# EAGLE design mintyboostv3 (EAGLE 5.01)
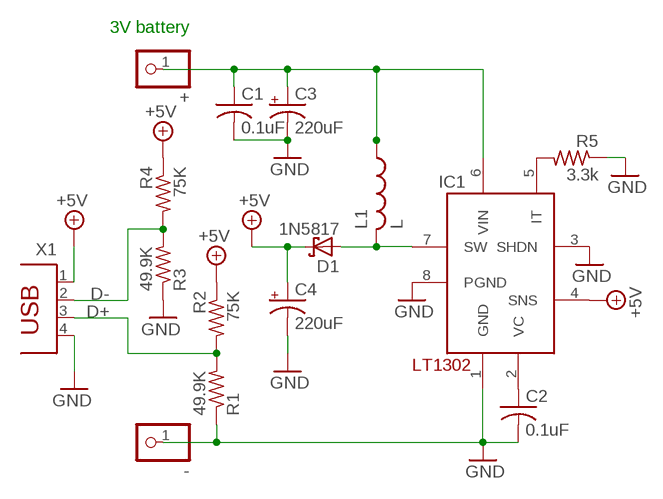
[diagram p0: schematic, sheet 1]

## Parts
+  PINHD-1X1  [1X01]
-  PINHD-1X1  [1X01]
C1  0.1uF  C-US025-025X050  [C025-025X050]
C2  0.1uF  C-US025-025X050  [C025-025X050]
C3  220uF  CPOL-USE2.5-5  [E2,5-5]
C4  220uF  CPOL-USE2.5-5  [E2,5-5]
D1  1N5817  SCHOTTKY-DIODEDO41-7  [DO41-7]
IC1  LT1302  [DIL08]
L1  L  [6000]
R1  49.9K  R-US_0204/5  [0204/5]
R2  75K  R-US_0204/5  [0204/5]
R3  49.9K  R-US_0204/5  [0204/5]
R4  75K  R-US_0204/5  [0204/5]
R5  3.3k  R-US_0204/5  [0204/5]
X1  PN87520  [PN87520]

## Nets
+5V: C4.+ D1.C IC1.4(SNS) R2.1 R4.1 X1.1
BATT+: +.1 C1.1 C3.+ IC1.6(VIN) L1.1
D+: R1.2 R2.2 X1.3
D-: R3.2 R4.2 X1.2
GND: -.1 C1.2 C2.2 C3.- C4.- IC1.1(GND) IC1.3(SHDN) IC1.8(PGND) R1.1 R3.1 R5.1 X1.4
N$1: C2.1 IC1.2(VC)
N$2: IC1.5(IT) R5.2
N$5: D1.A IC1.7(SW) L1.2

## Notes on the sheet
- 3V battery

## Library data of the parts
+ - = pinhead-ez:PINHD-1X1: PIN HEADER
C1 C2 = adafruit:C-US: CAPACITOR, American symbol
C3 C4 = adafruit:CPOL-US: POLARIZED CAPACITOR, American symbol
D1 = adafruit:SCHOTTKY-DIODE: Schottky Diode
IC1 = adafruit:LT1302
L1 = adafruit:L
R1-R5 = adafruit:R-US_: RESISTOR, American symbol
X1 = con-berg:PN87520: BERG USB connector

## Board
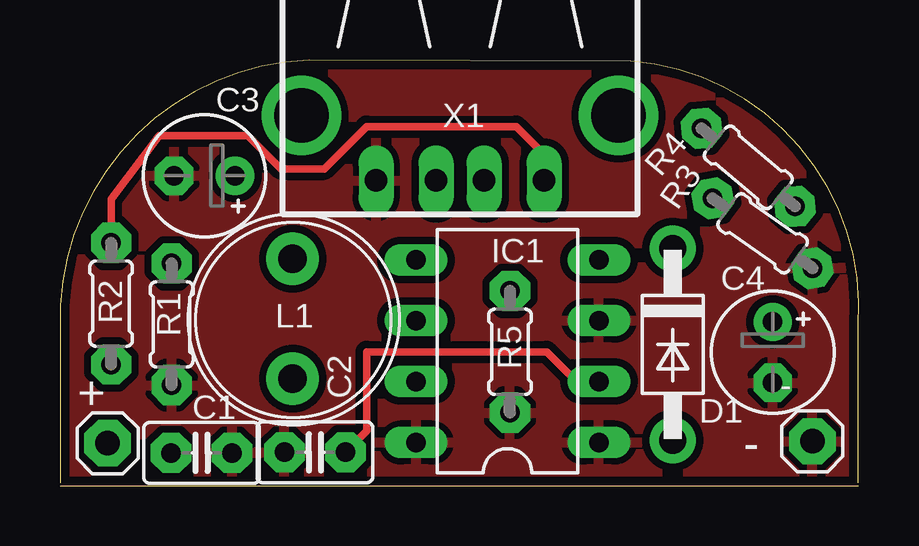
[diagram p1: board, top side]
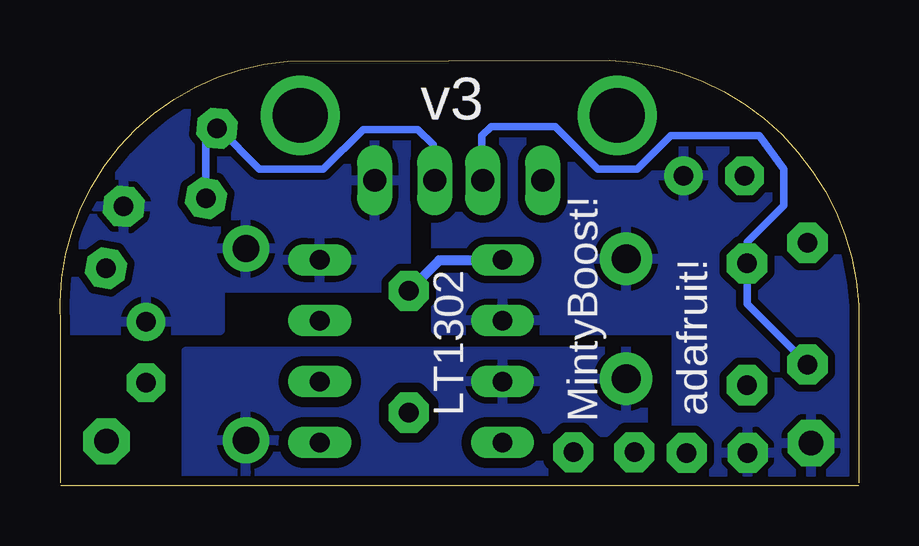
[diagram p2: board, bottom side, seen from below]

Size 33.28 x 17.76 mm. Coordinates in mm from the lower left corner, seen from the top.
Outline: 0,0.12 0,6.54 arc-90 10.38,17.76 23.79,17.71 arc-90 33.25,6.64 33.25,0.12
Outline: 0,0 33.25,0
Copper layers (1*16): Top 0.035mm / dielectric 1.5mm / Bottom 0.035mm
Design rules "default *": minimum track width 12mil, minimum drill 20mil, track to track 12mil, track to pad 12mil, pad to pad 30mil, via to via 12mil, smd to smd 0mil, copper to edge 15mil, drill to drill 8mil, minimum pad ring 10mil, minimum via ring 8mil, stop-mask expansion 4mil, vias tented up to drill 0mil, thermal gap 10mil

### Footprints (pad centres in the part's own frame; a part is rotated, then mirrored left to right if it is on the bottom)
1X01 = drill 1.016 pad 1.93 octagon: 1 0,0
C025-025X050 = drill 0.813 pad 1.676 octagon: 1 -1.27,0; 2 1.27,0
E2,5-5 = drill 0.813 pad 1.6 round: + -1.27,0 | drill 0.813 pad 1.6 octagon: - 1.27,0
DO41-7 = drill 1.118 pad 1.93 round: A 4,0; C -4,0
DIL08 = drill 0.813 long: 1 -3.81,-3.81; 2 -1.27,-3.81; 3 1.27,-3.81; 4 3.81,-3.81; 5 3.81,3.81; 6 1.27,3.81; 7 -1.27,3.81; 8 -3.81,3.81
6000 = drill 1.2 pad 2.184 round: 1 -2.5,0; 2 2.5,0
0204/5 = drill 0.813 pad 1.676 octagon: 1 -2.54,0; 2 2.54,0
PN87520 = drill 0.95 long: 1 -3.5,2.71; 2 -1,2.71; 3 1,2.71; 4 3.5,2.71 | drill 2.286 round: P$1 -6.604,0; P$2 6.604,0

### Placement (x,y rotation side)
+  1.99,1.78 0 top
-  31.35,1.85 0 top
C1  5.9,1.37 0 top
C2  10.62,1.4 180 top
C3  6.02,12.93 180 top
C4  29.7,5.56 270 top
D1  25.53,5.89 270 top
IC1  18.65,5.61 90 top
L1  9.69,6.97 270 top
R1  4.65,6.73 90 top
R2  2.13,7.6 270 top
R3  29.28,10.53 145 top
R4  28.68,13.28 140 top
R5  18.75,5.59 90 top
X1  16.67,15.44 180 top

### Tracks (layer width: path | path; a pad name or v marks a point on that pad's centre or on a via)
+5V
  Top 0.305: R2.1 2.13,11.96 4.14,14.61 7.83,14.61 9.22,13.21 11,13.21 12.78,14.99 19,14.99 20.27,13.72 20.27,12.7 20.24,12.73 X1.1
  Bottom 0.406: X1.1 20.17,12.93
  pour Bottom (isolate 0.305): 18.88,17.27 18.88,8.26 26.62,8.26 26.62,6.48 32.97,6.48 arc90 22.18,17.27
BATT+
  pour Bottom (isolate 0.305): 7.57,0.51 7.57,6.48 17.61,6.48 17.61,15.11 4.27,15.11 arc90 0.21,7.11 0.21,0.25 arc-90 0.33,0.38 7.45,0.38 arc90
D+
  Bottom 0.305: R2.2 4.65,7.58 R1.2 4.65,10.16 3.13,11.68 3.13,13.21 4.14,14.61 7.83,14.61 9.22,13.21 10.88,13.21 12.65,14.99 15.32,14.99 15.7,14.61 15.7,12.83 15.67,12.79 X1.3
D-
  Bottom 0.305: R3.2 27.2,14.41 26.73,14.88 R4.2 26.67,14.91 24.97,13.21 22.31,13.21 20.65,14.86 18.37,14.86 17.73,14.22 17.73,12.83 17.64,12.73 | 17.64,12.73 17.61,12.7 | X1.2 17.64,12.73
GND
  pour Top (isolate 0.305): -0.17,-0.13 -0.17,8.26 arc-90 9.1,17.91 23.07,17.91 arc-90 33.61,7.37 33.61,-0.13
N$1
  Top 0.305: C2.1 12.78,2.29 12.78,5.59 20.27,5.59 21.54,4.32 22.48,4.32 | 22.48,4.32 22.69,4.32 | 22.48,4.32 IC1.2
N$2
  Bottom 0.406: IC1.5 14.81,9.4 17.48,9.4 R5.2
N$5
  pour Bottom (isolate 0.406): 8.97,5.59 28.02,5.59 28.02,0.25 8.97,0.25

### Text on the board
tPlace: + | -
bPlace: v3 | LT1302 | adafruit! | MintyBoost!